# Altium schematic sheet PAGE1-MCU,USB,ADC.SchDoc (part 2 of 2)
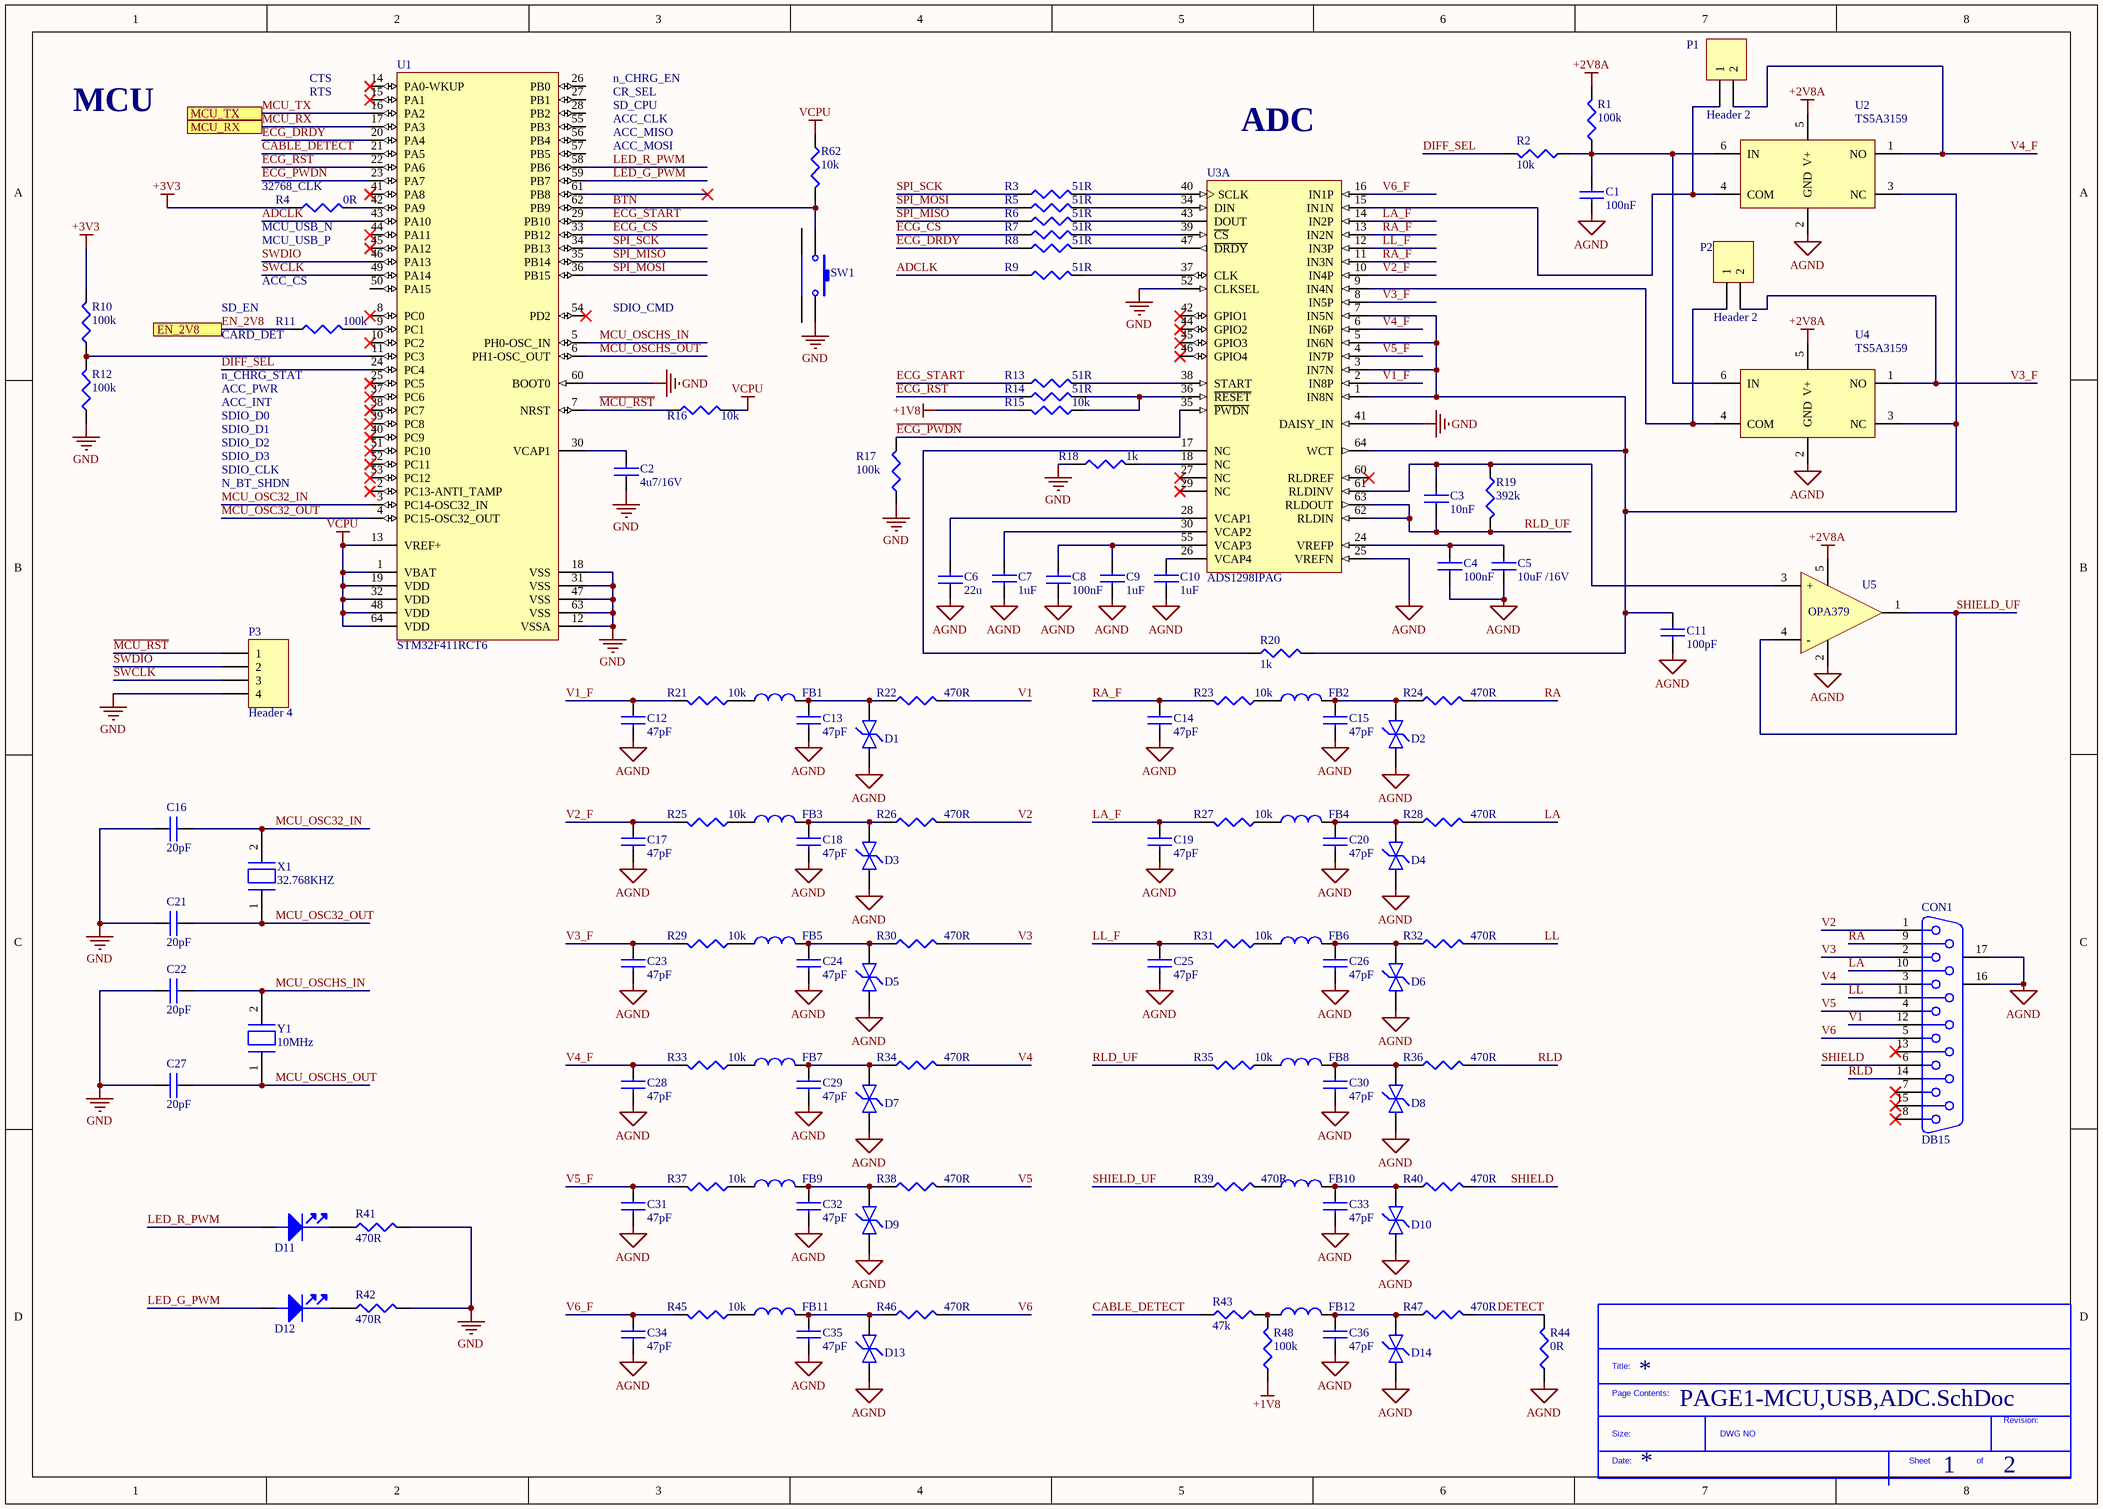
[diagram p1: PAGE1-MCU,USB,ADC.SchDoc]

## Library data of the parts
C1 C4 C8 = 100nF: MURATA - GRM188R71C104KA01J - CAP, MLCC, X7R, 0.1UF, 16V, 0603; Ceramic Capacitor Case: 0603 [1608 Metric]; Capacitance: 0.1; Voltage Rating: 16; Capacitance Tolerance: ± 10%; Dielectric Characteristic: X7; Product Range: GRM Series; SVHC: No SVHC (20-Jun-2016; Supplier 1: Farnell; Manufacturer: MURATA; Manufacturer Part Number: GRM188R71C104KA01J; RoHS: YES; Stock 1: 18297; Pricing 1: 10=0.0145, 100=0.0126, 500=0.0081, 2500=0.0059, 5000=0.0052, 10000=0.0046, 50000=0.0036, 100000=0.0035 (GBP); Packaging: Cut Tape; Operating Temperature Min: -55; Operating Temperature Max: 125; Automotive Qualification Standard: -; MSL: MSL 1 - Unlimited; ComponentLink1URL: http://www.farnell.com/datasheets/2189124.pdf; ComponentLink1Description: http://www.farnell.com/datasheets/2189124.pdf; Supplier Part Number 1: 2688519
C2 = 4u7  16V 0603: MURATA - GRM188R61C475KAAJD - CAP, MLCC, X5R, 4.7UF, 16V, 0603; Ceramic Capacitor Case: 0603 [1608 Metric]; Capacitance: 4.7; Voltage Rating: 16; Capacitance Tolerance: ± 10%; Dielectric Characteristic: X5; Product Range: GRM Series; SVHC: No SVHC (17-Dec-2015)<!--FANDB--><div class="features-and-benefits-container"><div class="features-and-benefits-desc-container"><span class="features-and-benefits-container-desc">SMD Multilayer Ceramic Capacitor, 0603 [1608 Metric], 4.7 µF, 16 V, ± 10%, X5; Supplier 1: Farnell; Manufacturer: MURATA; Manufacturer Part Number: GRM188R61C475KAAJD; RoHS: YES; Stock 1: 5038; Pricing 1: 10=0.16, 100=0.0929, 500=0.076, 1000=0.0618, 2000=0.0605, 4000=0.0425, 20000=0.0409, 40000=0.0355 (GBP); Packaging: Cut Tape; Operating Temperature Min: -55; Operating Temperature Max: 85; Automotive Qualification Standard: -; MSL: MSL 1 - Unlimited; ComponentLink1URL: http://www.farnell.com/datasheets/2079168.pdf; ComponentLink1Description: http://www.farnell.com/datasheets/2079168.pdf; Supplier Part Number 1: 2611924
C3 = 10nF: KEMET - C0603X103K5RECAUTO - CAP, MLCC, AEC-Q200, X7R, 0.01UF, 50V; Manufacturer: TDK EPCOS; Supplier 1: Farnell; Manufacturer Part Number: C0603X103K5RECAUTO; Stock 1: 307350; Pricing 1: 10=0.133, 100=0.0731, 500=0.055, 1000=0.0465, 2000=0.0408, 4000=0.0336, 20000=0.0295 (GBP); ComponentLink1URL: http://www.farnell.com/datasheets/2290180.pdf; ComponentLink1Description: http://www.farnell.com/datasheets/2290180.pdf; Supplier Part Number 1: 2760492
C5 = 10uF /16V: TDK - CGA4J1X5R1C106K125AC - CAP, MLCC, X5R, 10UF, 16V, 0805; Supplier 1: Farnell; Manufacturer: TDK; Manufacturer Part Number: CGA4J1X5R1C106K125AC; RoHS: YES; Stock 1: 8974; Pricing 1: 5=0.41, 50=0.146, 250=0.131, 500=0.12, 1000=0.103 (GBP); ComponentLink1URL: http://bcove.me/e1v54mtm; ComponentLink1Description: http://bcove.me/e1v54mtm; ComponentLink2URL: http://www.farnell.com/datasheets/1936565.pdf; ComponentLink2Description: http://www.farnell.com/datasheets/1936565.pdf; ComponentLink3URL: http://www.farnell.com/datasheets/1683658.pdf; ComponentLink3Description: http://www.farnell.com/datasheets/1683658.pdf; Supplier Part Number 1: 2210948RL
C6 = 22u 6.3V 0805: MULTICOMP - MC0805X226M6R3CT - CAP, MLCC, X5R, 22UF, 0805; Ceramic Capacitor Case: 0805 [2012 Metric]; Capacitance: 22; Voltage Rating: 6.3; Capacitance Tolerance: ± 20%; Dielectric Characteristic: X5; Product Range: MC Series; SVHC: No SVHC (07-Jul-2017); Capacitor Terminals: SMD; Supplier 1: Farnell; Manufacturer: MULTICOMP; Manufacturer Part Number: MC0805X226M6R3CT; RoHS: YES; Stock 1: 74736; Pricing 1: 5=0.128, 50=0.0738, 250=0.0507, 500=0.042, 1500=0.0358 (GBP); Packaging: Cut Tape; Operating Temperature Min: -55; Operating Temperature Max: 85; Automotive Qualification Standard: -; MSL: -; Capacitance Tolerance ±: ± 20%; Operating Temperature Range: -55°C to +85°C<!--FANDB--><div class="features-and-benefits-container"><div class="features-and-benefits-desc-container"><span class="features-and-benefits-container-desc">SMD Multilayer Ceramic Capacitor, 0805 [2012 Metric], 22 µF, 6.3 V, ± 20%, X5R, MC Series</span></div><div class="features-and-benefits-description"><span class="features-benefits-value">The Multicomp MC series is general purpose MLCC capacitors with X5R dielectric material which provides high electrical precision, stability and reliability. This MLCC capacitor consists of a conducting material and electrodes with high density and high efficiency ceramic condensers.</span></div><div class="features-and-benefits-list"><ul class="features-and-benefits-list-list"><li class="features-and-benefits-list-item">Small size with higher capacitance values</li><li class="features-and-benefits-list-item">0201, 0402, 0603, 0805, 1206, 1210, 1812 case sizes available</li><li class="features-and-benefits-list-item">Capacitance value ranging from 100pF to 220?F</li><li class="features-and-benefits-list-item">Capacitor with lead free termination (pure Tin)</li><li class="features-and-benefits-list-item">High electrical precision, stability and reliability</li><li class="features-and-benefits-list-item">Rated voltage of 4V, 6.3V, 10V, 16V, 25V, 50V</li><li class="features-and-benefits-list-item">Operating temperature of -55°C to +85°C</li><li class="features-and-benefits-list-item">Available in ±10% and ±20; ComponentLink1URL: http://www.farnell.com/datasheets/1901289.pdf; ComponentLink1Description: http://www.farnell.com/datasheets/1901289.pdf; ComponentLink2URL: http://www.farnell.com/datasheets/1932399.pdf; ComponentLink2Description: http://www.farnell.com/datasheets/1932399.pdf; Supplier Part Number 1: 1759415
C7 C9 C10 = 1uF: MURATA - GRM188R61H105KAALD - CAP, MLCC, X5R, 1UF, 50V, 0603; Ceramic Capacitor Case: 0603 [1608 Metric]; Capacitance: 1; Voltage Rating: 50; Capacitance Tolerance: ± 10%; Dielectric Characteristic: X5; Product Range: GRM Series; SVHC: No SVHC (17-Dec-2015); Capacitor Terminals: SMD<!--FANDB--><div class="features-and-benefits-container"><div class="features-and-benefits-description"><span class="features-benefits-value">The Murata GRM series capacitors are Multilayer Ceramic Chip Capacitors (MLCC) used for general purpose applications. These MLCC capacitors are classified into temperature compensating and high dielectric constant types depending on the change in electrostatic capacitance due to change in temperature. The temperature compensating capacitors feature a small rate of change in electrostatic capacitance as the temperature changes and are used for applications such as filters and high frequency circuit matching. The high dielectric constant capacitors use materials with a high dielectric constant and feature a large electrostatic capacitance. Typical applications are power supply decoupling and smoothing circuits.</span></div><div class="features-and-benefits-list"><ul class="features-and-benefits-list-list"><li class="features-and-benefits-list-item">Large capacity and small size in a multilayer structure</li><li class="features-and-benefits-list-item">Capacitance value ranging from 0.1pF to 220?F</li><li class="features-and-benefits-list-item">Tin plated external electrodes, excellent solderability</li><li class="features-and-benefits-list-item">Provides good high frequency characteristics</li><li class="features-and-benefits-list-item">Excellent pulse response</li><li class="features-and-benefits-list-item">High reliability</li><li class="features-and-benefits-list-item">Capacitor size varies from 0.4×0.2mm to 5.7×5.0mm</li><li class="features-and-benefits-list-item">Rated voltage of 2.5VDC to 3.15; Supplier 1: Farnell; Manufacturer: MURATA; Manufacturer Part Number: GRM188R61H105KAALD; RoHS: YES; Stock 1: 62682; Pricing 1: 10=0.093, 100=0.062, 500=0.0507, 1000=0.0465, 2000=0.0429, 4000=0.0399, 20000=0.0372, 40000=0.0365 (GBP); Packaging: Cut Tape; Operating Temperature Min: -55; Operating Temperature Max: 85; Automotive Qualification Standard: -; MSL: -; Capacitance Tolerance ±: ± 10%; ComponentLink1URL: http://www.farnell.com/datasheets/2048611.pdf; ComponentLink1Description: http://www.farnell.com/datasheets/2048611.pdf; Supplier Part Number 1: 1845736
C11 = 100pF: MULTICOMP   MCSH18B101K500CT   SMD Multilayer Ceramic Capacitor, MCSH Series, 100 pF,  10%, X7R, 50 V, 0603 [1608 Metric]; Voltage Rating: 50V; Supplier 1: Farnell; Manufacturer: Multicomp; Manufacturer Part Number: MCSH18B101K500CT; Stock 1: 9630; Pricing 1: 10=0.0858, 100=0.0386, 500=0.0266, 1000=0.0203, 2000=0.0176 (EUR); Case/Package: 0603; Case Code (Metric): 1608; Case Code (Imperial): 0603; Min Operating Temperature: -55°C; Max Operating Temperature: 125°C; Packaging: Cut Tape; Capacitance: 100pF; Tolerance: 10%; Dielectric: X7R; Voltage Rating (DC): 50V; REACH SVHC: No SVHC; ComponentLink1URL: https://datasheet.ciiva.com/36858/1825494-36858405.pdf; ComponentLink1Description: https://datasheet.ciiva.com/36858/1825494-36858405.pdf; ComponentLink2URL: https://datasheet.ciiva.com/36855/1825494-36855530.pdf; ComponentLink2Description: https://datasheet.ciiva.com/36855/1825494-36855530.pdf; Supplier Part Number 1: 1856366
C12-C15 C17-C20 C23-C26 C28-C36 = 47pF: CAP CER 47PF 50V NP0 0603; Manufacturer: KEMET; Manufacturer Part Number: C0603C470J5GACTU; Dielectric Material: Ceramic; Tolerance: 5%; Dielectric: C0G; Temperature Coefficient: 30ppm/°C; Supplier 1: Farnell; Stock 1: 63826; Pricing 1: 10=0.0233, 100=0.0154, 500=0.0102, 1000=0.0076, 2000=0.0073 (GBP); Mount: Surface Mount,PCB; Case/Package: 0603; Number of Pins: 2; Case Code (Imperial): 0603; Case Code (Metric): 1608; Contact Material: Tin; Contact Plating: Tin,Matte; Min Operating Temperature: -55°C; Max Operating Temperature: 125°C; Capacitance: 47pF; Voltage Rating: 50V; Voltage Rating (DC): 50V; Package Quantity: 1; Packaging: Tape and Reel; Termination: SMD/SMT; Voltage: 50V; Length: 1.6mm; Height: 0.8mm; Width: 0.031inch; Lead Pitch: 0.7mm; Thickness: 0.034inch; Depth: 0.8mm; Radiation Hardening: No; REACH SVHC: No SVHC; Lead Free: Lead Free; ComponentLink1URL: https://datasheet.ciiva.com/144/docfinderpartnumber-c0603c470j5gactu-144266.pdf; ComponentLink1Description: https://datasheet.ciiva.com/144/docfinderpartnumber-c0603c470j5gactu-144266.pdf; ComponentLink2URL: https://datasheet.ciiva.com/7823/kem-c1003-c0g-smd-7823781.pdf; ComponentLink2Description: https://datasheet.ciiva.com/7823/kem-c1003-c0g-smd-7823781.pdf; ComponentLink3URL: https://datasheet.ciiva.com/7823/kem-c1003-c0g-smd-7823782.pdf; ComponentLink3Description: https://datasheet.ciiva.com/7823/kem-c1003-c0g-smd-7823782.pdf; ComponentLink4URL: https://datasheet.ciiva.com/14588/70095383-14588998.pdf; ComponentLink4Description: https://datasheet.ciiva.com/14588/70095383-14588998.pdf; ComponentLink5URL: https://datasheet.ciiva.com/32432/kem-c1003-c0g-eng-tds-32432423.pdf; ComponentLink5Description: https://datasheet.ciiva.com/32432/kem-c1003-c0g-eng-tds-32432423.pdf; ComponentLink6URL: https://datasheet.ciiva.com/18193/getdatasheetpartid-120905-18193050.pdf; ComponentLink6Description: https://datasheet.ciiva.com/18193/getdatasheetpartid-120905-18193050.pdf; ComponentLink7URL: https://datasheet.ciiva.com/14589/70095383-14589564.pdf; ComponentLink7Description: https://datasheet.ciiva.com/14589/70095383-14589564.pdf; ComponentLink8URL: https://datasheet.ciiva.com/28668/1789732-28668701.pdf; ComponentLink8Description: https://datasheet.ciiva.com/28668/1789732-28668701.pdf; Supplier Part Number 1: 1414639
C16 C21 C22 C27 = 20pF: MURATA - GRM1885C1H200JA01D - CAPACITOR, MLCC, C0G, 20PF, 50V, 0603; Ceramic Capacitor Case: 0603 [1608 Metric]; Capacitance: 20; Voltage Rating: 50; Capacitance Tolerance: ± 5%; Dielectric Characteristic: C0G / NP0; Product Range: GRM Series; SVHC: No SVHC (17-Dec-2015; Supplier 1: Farnell; Manufacturer: MURATA; Manufacturer Part Number: GRM1885C1H200JA01D; RoHS: YES; Stock 1: 5812; Pricing 1: 10=0.0245, 100=0.0159, 500=0.0123, 1000=0.0095, 2000=0.0093, 4000=0.0073, 20000=0.0062, 40000=0.0057 (GBP); Packaging: Cut Tape; Operating Temperature Min: -55; Operating Temperature Max: 125; Automotive Qualification Standard: -; MSL: MSL 1 - Unlimited; ComponentLink1URL: http://www.farnell.com/datasheets/2048077.pdf; ComponentLink1Description: http://www.farnell.com/datasheets/2048077.pdf; Supplier Part Number 1: 2456108
CON1 = 5207827-4: D-Sub Standard Connectors DSUB A15S V/MNT; Manufacturer: TE Connectivity; Body Material: Plastic; Voltage Rating: 125V; Current Rating: 6A; Gender: Female; Connector Type: Receptacle; Number of Positions: 15; Number of Ports: 1; Mating Connector Lock: No (Without); PCB Mount Retention: With; PCB Mounting Orientation: Vertical; Preloaded: Yes; Pitch: 0.108inch; PCB Thickness: 2.36mm; Hole Diameter: 0.12inch; Supplier 1: Farnell; Manufacturer Part Number: 5207827-4; Stock 1: 0; Mount: Through Hole; Color: Black; Contact Plating: Gold,Nickel,Tin; Contact Material: Bronze; Number of Terminals: 15; Housing Color: Black; Housing Material: Thermoplastic; Contact Shape: Round; Min Operating Temperature: -55°C; Max Operating Temperature: 105°C; Package Quantity: 13; Number of Rows: 2; Packaging: Rail/Tube; Termination: Solder; Number of Contacts: 15; Orientation: Straight; Sealable: No (Without); Length: 39.14mm; Width: 12.17mm; Depth: 10.41mm; Termination Post Length: 0.125inch; Radiation Hardening: No; REACH SVHC: Unknown; Lead Free: Lead Free; ELV: Compliant; Flammability Rating: UL94 V-0; ComponentLink1URL: http://www.te.com/commerce/DocumentDelivery/DDEController?Action=srchrtrv&DocNm=5207827&DocType=Customer+Drawing&DocLang=English; ComponentLink1Description: http://www.te.com/commerce/DocumentDelivery/DDEController?Action=srchrtrv&DocNm=5207827&DocType=Customer+Drawing&DocLang=English; ComponentLink2URL: http://www.farnell.com/cad/1652241.pdf; ComponentLink2Description: http://www.farnell.com/cad/1652241.pdf; ComponentLink3URL: http://www.te.com/commerce/DocumentDelivery/DDEController?Action=srchrtrv&DocNm=82068_AMPLIMITE_Straight_Posted_Conns&DocType=Catalog+Section&DocLang=English; ComponentLink3Description: http://www.te.com/commerce/DocumentDelivery/DDEController?Action=srchrtrv&DocNm=82068_AMPLIMITE_Straight_Posted_Conns&DocType=Catalog+Section&DocLang=English; ComponentLink4URL: https://www.verical.com/server-webapp/html/getDatasheet?partID=46991; ComponentLink4Description: https://www.verical.com/server-webapp/html/getDatasheet?partID=46991; ComponentLink5URL: http://www.farnell.com/datasheets/1648470.pdf; ComponentLink5Description: http://www.farnell.com/datasheets/1648470.pdf; Supplier Part Number 1: 1815066
D1-D10 D13 D14 = TPD1E10B06DPYR: TVS DIODE 5.5VWM 14VC 2X2SON; Manufacturer: Texas Instruments; Capacitance: 12pF; Direction: Bidirectional; Breakdown Voltage: 6V; Number of Channels: 1; Reverse Standoff Voltage: 5.5V; Clamping Voltage: 14V; Peak Pulse Power: 90W; Power Line Protection: No; Leakage Current: 100nA; ESD Protection: Yes; Test Current: 1mA; Element Configuration: Single; Peak Pulse Current: 5A; Interface: GPIO; Supplier 1: Farnell; Manufacturer Part Number: TPD1E10B06DPYR; Stock 1: 6208; Pricing 1: 1=0.415, 50=0.312, 100=0.117, 250=0.108, 500=0.0992, 1000=0.0902 (EUR); Case/Package: 0402; Number of Pins: 2; Contact Plating: Gold; Min Operating Temperature: -40°C; Max Operating Temperature: 125°C; Package Quantity: 1; Packaging: Tape and Reel; Number of Bidirectional Channels: 1; Min Breakdown Voltage: 6V; Working Voltage: 5.5V; Max Reverse Leakage Current: 100nA; Length: 1.1mm; Height: 0.35mm; Width: 0.7mm; Radiation Hardening: No; REACH SVHC: No SVHC; Lead Free: Lead Free; ComponentLink1URL: https://datasheet.ciiva.com/26005/sllseb1b-26005840.pdf; ComponentLink1Description: https://datasheet.ciiva.com/26005/sllseb1b-26005840.pdf; ComponentLink2URL: https://datasheet.ciiva.com/46384/1877100-46384054.pdf; ComponentLink2Description: https://datasheet.ciiva.com/46384/1877100-46384054.pdf; ComponentLink3URL: https://datasheet.ciiva.com/14195/tpd1e10b06-14195178.pdf; ComponentLink3Description: https://datasheet.ciiva.com/14195/tpd1e10b06-14195178.pdf; ComponentLink4URL: https://datasheet.ciiva.com/22691/1877100-22691786.pdf; ComponentLink4Description: https://datasheet.ciiva.com/22691/1877100-22691786.pdf; ComponentLink5URL: https://datasheet.ciiva.com/2961/tpd1e10b06-2961245.pdf; ComponentLink5Description: https://datasheet.ciiva.com/2961/tpd1e10b06-2961245.pdf; ComponentLink6URL: https://datasheet.ciiva.com/2961/tpd1e10b06-2961246.pdf; ComponentLink6Description: https://datasheet.ciiva.com/2961/tpd1e10b06-2961246.pdf; ComponentLink7URL: https://datasheet.ciiva.com/6574/tpd1e10b06-6574654.pdf; ComponentLink7Description: https://datasheet.ciiva.com/6574/tpd1e10b06-6574654.pdf; Supplier Part Number 1: 2345930
D11 D12 = LED RED: BROADCOM LIMITED - HSMS-C190 - LED, RED, 10MCD, 626NM; LED Mounting: SMD; Forward Current If: 20; Forward Voltage: 2.1; Wavelength Typ: 626; Luminous Intensity: 10; Viewing Angle: 170°; Lens Shape: Rectangular; SVHC: No SVHC (17-Dec-2015)<!--FANDB--><div class="features-and-benefits-container"><div class="features-and-benefits-description"><span class="features-benefits-value">The HSMS-C190 is a HER SMD Chip LED with untinted/diffused lens, made of GaP. It is designed in an industry standard package 1.6 x 0.8mm footprint with 0.8mm profile. It is compatible with IR reflow solder processes. The small size and wide viewing angle make this LED prime choices for backlighting applications and front panel illumination especially where space is a premium.</span></div><div class="features-and-benefits-list"><ul class="features-and-benefits-list-list"><li class="features-and-benefits-list-item">Small size</li><li class="features-and-benefits-list-item">Industry standard footprint</li><li class="features-and-benefits-list-item">Compatible with IR solder</li><li class="features-and-benefits-list-item">Diffused optics</li><li class="features-and-benefits-list-item">-40 to 85; Supplier 1: Farnell; Manufacturer: BROADCOM LIMITED; Manufacturer Part Number: HSMS-C190; RoHS: YES; Stock 1: 7534; Pricing 1: 1=0.361, 10=0.256, 50=0.235, 100=0.106, 200=0.101 (GBP); LED Colour: Red; Bulb Size: -; Packaging: Cut Tape; Product Range: -; Automotive Qualification Standard: -; MSL: -; ComponentLink1URL: http://www.farnell.com/datasheets/313031.pdf; ComponentLink1Description: http://www.farnell.com/datasheets/313031.pdf; ComponentLink2URL: http://www.farnell.com/datasheets/1681524.pdf; ComponentLink2Description: http://www.farnell.com/datasheets/1681524.pdf; ComponentLink3URL: http://www.farnell.com/datasheets/2165483.pdf; ComponentLink3Description: http://www.farnell.com/datasheets/2165483.pdf; Supplier Part Number 1: 2497356
FB1-FB12 = BLM15PG100SN1D: Ferrite Beads Multi-Layer 10Ohm 100MHz 1A 50mOhm DCR 0402 T/R; Manufacturer: Murata; Material: Steel; Impedance: 10R; Number of Lines: 1; DC Resistance (DCR): 25mR; Shielding: Unshielded; Tolerance: 25%; Supplier 1: Farnell; Manufacturer Part Number: BLM15PG100SN1D; Stock 1: 794; Pricing 1: 10=0.03, 100=0.0217, 500=0.0163, 2500=0.0122, 5000=0.01, 10000=0.0089, 50000=0.007 (EUR); Case/Package: 0402; Number of Pins: 2; Core Material: Ferrite; Case Code (Metric): 1005; Case Code (Imperial): 0402; Min Operating Temperature: -55°C; Max Operating Temperature: 125°C; Packaging: Tape and Reel; Current Rating: 1A; Number of Circuits: 1; Package Quantity: 1; Max Current Rating: 1A; Termination: SMD/SMT; Max DC Current: 1A; Test Frequency: 100MHz; Length: 1mm; Height: 0.5mm; Width: 0.5mm; Depth: 0.55mm; REACH SVHC: No SVHC; Lead Free: Lead Free; ComponentLink1URL: https://datasheet.ciiva.com/41449/001172209-da-01-en-drossel-0402-10r-1-0x0-5mm-10000st-41449496.pdf; ComponentLink1Description: https://datasheet.ciiva.com/41449/001172209-da-01-en-drossel-0402-10r-1-0x0-5mm-10000st-41449496.pdf; ComponentLink2URL: https://datasheet.ciiva.com/46423/1851892-46423898.pdf; ComponentLink2Description: https://datasheet.ciiva.com/46423/1851892-46423898.pdf; ComponentLink3URL: https://datasheet.ciiva.com/6211/l0110e-6211726.pdf; ComponentLink3Description: https://datasheet.ciiva.com/6211/l0110e-6211726.pdf; Supplier Part Number 1: 2443233
P1 P2 = Header 2: Header, 2-Pin; LatestRevisionDate: 17-Jul-2002; LatestRevisionNote: Re-released for DXP Platform.; Publisher: Altium Limited
P3 = Header 4: Header, 4-Pin; LatestRevisionDate: 17-Jul-2002; LatestRevisionNote: Re-released for DXP Platform.; Publisher: Altium Limited
R1 R10-R12 R17 R48 = 100k: MULTICOMP - MCMR06X104 JTL - RES, CERAMIC, 100K, 5%, 0.1W, 0603; Resistance: 100; Voltage Rating: 75; Resistor Case Style: 0603 [1608 Metric]; Product Range: MCMR Series; Temperature Coefficient: ± 100; Resistor Mounting: Surface Mount Device<!--FANDB--><div class="features-and-benefits-container"><div class="features-and-benefits-description"><span class="features-benefits-value">The Multicomp MCMR series resistors are automotive grade, anti sulphured thick film chip resistor. The resistance range includes E24 and E96 decade values from 1ohm to 10Mohm. These resistors are constructed on top of a high grade ceramic body.</span></div><div class="features-and-benefits-list"><ul class="features-and-benefits-list-list"><li class="features-and-benefits-list-item">EIA 0402, 0603, 0805, 1206 chip sizes available</li><li class="features-and-benefits-list-item">High reliability and stability</li><li class="features-and-benefits-list-item">Automotive grade AEC-Q200 compliant</li><li class="features-and-benefits-list-item">Complaint with (IEC 60068-1) 55/155/56 climatic category</li><li class="features-and-benefits-list-item">Maximum operation voltage of 50V, 75V, 150V and 200V</li><li class="features-and-benefits-list-item">Power rating of 62.5mW, 100mW, 125mW and 250mW</li><li class="features-and-benefits-list-item">Available in ±1% and ±5% tolerance</li><li class="features-and-benefits-list-item">Temperature coefficient (TCR) of +200ppm/°C, +100ppm/°C and -200ppm/°C to +400ppm/°C</li><li class="features-and-benefits-list-item">Operating temperature range -55°C to 155; Supplier 1: Farnell; Manufacturer: MULTICOMP; Manufacturer Part Number: MCMR06X104 JTL; RoHS: Y-EX; Stock 1: 187; Pricing 1: 10=0.0109, 100=0.0085, 500=0.006, 1000=0.0048, 2500=0.004, 5000=0.003, 25000=0.002, 50000=0.0016 (GBP); Power Rating: 100; Resistance Tolerance: ± 5%; Packaging: Cut Tape; Resistor Element Material: Ceramic; Automotive Qualification Standard: -; ComponentLink1URL: http://www.farnell.com/datasheets/1716707.pdf; ComponentLink1Description: http://www.farnell.com/datasheets/1716707.pdf; Supplier Part Number 1: 2073357
R2 R15 R16 R21 R23 R25 R27 R29 R31 R33 R35 R37 R45 R62 = 10k: MULTICOMP - MCMR06X103 JTL - RES, CERAMIC, 10K, 5%, 0.1W, 0603; Resistance: 10; Voltage Rating: 75; Resistor Case Style: 0603 [1608 Metric]; Power Rating: 100; Product Range: MCMR Series; Temperature Coefficient: ± 100; Automotive Qualification Standard: -<!--FANDB--><div class="features-and-benefits-container"><div class="features-and-benefits-description"><span class="features-benefits-value">The Multicomp MCMR series resistors are automotive grade, anti sulphured thick film chip resistor. The resistance range includes E24 and E96 decade values from 1ohm to 10Mohm. These resistors are constructed on top of a high grade ceramic body.</span></div><div class="features-and-benefits-list"><ul class="features-and-benefits-list-list"><li class="features-and-benefits-list-item">EIA 0402, 0603, 0805, 1206 chip sizes available</li><li class="features-and-benefits-list-item">High reliability and stability</li><li class="features-and-benefits-list-item">Automotive grade AEC-Q200 compliant</li><li class="features-and-benefits-list-item">Complaint with (IEC 60068-1) 55/155/56 climatic category</li><li class="features-and-benefits-list-item">Maximum operation voltage of 50V, 75V, 150V and 200V</li><li class="features-and-benefits-list-item">Power rating of 62.5mW, 100mW, 125mW and 250mW</li><li class="features-and-benefits-list-item">Available in ±1% and ±5% tolerance</li><li class="features-and-benefits-list-item">Temperature coefficient (TCR) of +200ppm/°C, +100ppm/°C and -200ppm/°C to +400ppm/°C</li><li class="features-and-benefits-list-item">Operating temperature range -55°C to 155; Supplier 1: Farnell; Manufacturer: MULTICOMP; Manufacturer Part Number: MCMR06X103 JTL; RoHS: Y-EX; Stock 1: 19791; Pricing 1: 10=0.0087, 100=0.0074, 500=0.0061, 1000=0.0048, 2500=0.0032, 5000=0.0024, 25000=0.0016, 50000=0.0013 (GBP); Resistance Tolerance: ± 5%; Packaging: Cut Tape; Resistor Element Material: Ceramic; ComponentLink1URL: http://www.farnell.com/datasheets/1716707.pdf; ComponentLink1Description: http://www.farnell.com/datasheets/1716707.pdf; Supplier Part Number 1: 2073356
R3 R5-R9 R13 R14 = 51R: RES SMD 51 OHM 1% 1/10W 0603; Manufacturer: Vishay; Manufacturer Part Number: CRCW060351R0FKEA; Power Rating: 100mW; Voltage Rating: 75V; Temperature Coefficient: 100ppm/°C; Supplier 1: Farnell; Stock 1: 1083; Pricing 1: 10=0.0116, 250=0.0087, 500=0.0059, 1250=0.0052, 2500=0.0046 (GBP); Case/Package: 0603; Number of Pins: 2; Weight: 7.1E-05oz; Case Code (Imperial): 0603; Case Code (Metric): 1608; Contact Plating: Tin; Min Operating Temperature: -55°C; Max Operating Temperature: 155°C; Resistance: 51R; Tolerance: 1%; Packaging: Tape and Reel; Package Quantity: 10; Composition: Thick Film; Number of Terminations: 2; Military Standard: Not; Termination: SMD/SMT; Max Power Dissipation: 100mW; Voltage Rating (DC): 75V; Working Voltage: 75V; Length: 1.55mm; Height: 0.45mm; Width: 0.85mm; Depth: 0.85mm; Radiation Hardening: No; REACH SVHC: Unknown; Lead Free: Lead Free; ComponentLink1URL: https://datasheet.ciiva.com/11809/0900766b80d98afc-11809837.pdf; ComponentLink1Description: https://datasheet.ciiva.com/11809/0900766b80d98afc-11809837.pdf; ComponentLink2URL: https://datasheet.ciiva.com/3257/dcrcwe3-3257701.pdf; ComponentLink2Description: https://datasheet.ciiva.com/3257/dcrcwe3-3257701.pdf; ComponentLink3URL: https://datasheet.ciiva.com/5542/dcrcwe3-109170-5542133.pdf; ComponentLink3Description: https://datasheet.ciiva.com/5542/dcrcwe3-109170-5542133.pdf; ComponentLink4URL: https://datasheet.ciiva.com/7690/1697337-7690727.pdf; ComponentLink4Description: https://datasheet.ciiva.com/7690/1697337-7690727.pdf; ComponentLink5URL: https://datasheet.ciiva.com/7690/1720486-7690872.pdf; ComponentLink5Description: https://datasheet.ciiva.com/7690/1720486-7690872.pdf; ComponentLink6URL: https://datasheet.ciiva.com/22870/70201119-22870938.pdf; ComponentLink6Description: https://datasheet.ciiva.com/22870/70201119-22870938.pdf; ComponentLink7URL: https://datasheet.ciiva.com/2465/dcrcwe3-2465963.pdf; ComponentLink7Description: https://datasheet.ciiva.com/2465/dcrcwe3-2465963.pdf; ComponentLink8URL: https://datasheet.ciiva.com/16763/70201119-16763963.pdf; ComponentLink8Description: https://datasheet.ciiva.com/16763/70201119-16763963.pdf; ComponentLink9URL: https://datasheet.ciiva.com/2465/dcrcwe3-2465964.pdf; ComponentLink9Description: https://datasheet.ciiva.com/2465/dcrcwe3-2465964.pdf; ComponentLink10URL: https://datasheet.ciiva.com/2465/dcrcwe3-2465965.pdf; ComponentLink10Description: https://datasheet.ciiva.com/2465/dcrcwe3-2465965.pdf; ComponentLink11URL: https://datasheet.ciiva.com/26316/fld-crcw-e3-data-en-26316559.pdf; ComponentLink11Description: https://datasheet.ciiva.com/26316/fld-crcw-e3-data-en-26316559.pdf; Supplier Part Number 1: 1652889
R4 R44 = 0R: BOURNS - CR0603-J/-000ELF - RES, THICK FILM, 0R, 5%, 0.1W, 0603; Resistance: 0; Voltage Rating: 50; Resistor Case Style: 0603 [1608 Metric]; Power Rating: 100; Product Range: CR Series; SVHC: No SVHC (17-Dec-2015); Resistor Mounting: Surface Mount Device<!--FANDB--><div class="features-and-benefits-container"><div class="features-and-benefits-description"><span class="features-benefits-value">The Bourns CR series are standard thick film chip resistors. These resistors provide flexibility of performance, space saving and low cost. The Resistance range includes E96 and E24 decade values from 1ohm to 10Mohm.</span></div><div class="features-and-benefits-list"><ul class="features-and-benefits-list-list"><li class="features-and-benefits-list-item">0201, 0402, 0603, 0805, 1206, 1210, 2010, 2512 standard case sizes available</li><li class="features-and-benefits-list-item">±1% and ±5% tolerance</li><li class="features-and-benefits-list-item">±100ppm/°C, ±200ppm/°C and ±250ppm/°C TCR values available</li><li class="features-and-benefits-list-item">Power rating selectable for 50mW, 63mW, 0.1W, 0.125W, 0.25W, 0.5W and 1W based on ordering</li><li class="features-and-benefits-list-item">Jumpers are available for all size</li><li class="features-and-benefits-list-item">3 layer termination process with nickel barrier prevents leaching & provides excellent solderability</li><li class="features-and-benefits-list-item">Suitable for all type of soldering processes</li><li class="features-and-benefits-list-item">Tight dimensional tolerances</li><li class="features-and-benefits-list-item">Maximum working voltage depends on case size</li><li class="features-and-benefits-list-item">Operating temperature of -55°C to +125°C(CR0201) and -55°C to +155; Supplier 1: Farnell; Manufacturer: BOURNS; Manufacturer Part Number: CR0603-J/-000ELF; RoHS: YES; Stock 1: 58200; Pricing 1: 10=0.0146, 250=0.0097, 1000=0.0073, 5000=0.0049, 12500=0.0042 (GBP); Resistance Tolerance: ± 5%; Packaging: Cut Tape; Resistor Element Material: Thick Film; Temperature Coefficient: -; Automotive Qualification Standard: -; MSL: MSL 1 - Unlimited; ComponentLink1URL: http://www.bourns.com/engineering/CHPREZTR/cr0603.stp; ComponentLink1Description: http://www.bourns.com/engineering/CHPREZTR/cr0603.stp; ComponentLink2URL: http://www.farnell.com/datasheets/2178762.pdf; ComponentLink2Description: http://www.farnell.com/datasheets/2178762.pdf; Supplier Part Number 1: 2008343
R18 R20 = 1k: MULTICOMP - MCMR06X102 JTL - RES, CERAMIC, 1K, 5%, 0.1W, 0603; Resistance: 1; Voltage Rating: 75; Resistor Case Style: 0603 [1608 Metric]; Power Rating: 100; Product Range: MCMR Series; Temperature Coefficient: ± 100; Resistor Mounting: Surface Mount Device<!--FANDB--><div class="features-and-benefits-container"><div class="features-and-benefits-description"><span class="features-benefits-value">The Multicomp MCMR series resistors are automotive grade, anti sulphured thick film chip resistor. The resistance range includes E24 and E96 decade values from 1ohm to 10Mohm. These resistors are constructed on top of a high grade ceramic body.</span></div><div class="features-and-benefits-list"><ul class="features-and-benefits-list-list"><li class="features-and-benefits-list-item">EIA 0402, 0603, 0805, 1206 chip sizes available</li><li class="features-and-benefits-list-item">High reliability and stability</li><li class="features-and-benefits-list-item">Automotive grade AEC-Q200 compliant</li><li class="features-and-benefits-list-item">Complaint with (IEC 60068-1) 55/155/56 climatic category</li><li class="features-and-benefits-list-item">Maximum operation voltage of 50V, 75V, 150V and 200V</li><li class="features-and-benefits-list-item">Power rating of 62.5mW, 100mW, 125mW and 250mW</li><li class="features-and-benefits-list-item">Available in ±1% and ±5% tolerance</li><li class="features-and-benefits-list-item">Temperature coefficient (TCR) of +200ppm/°C, +100ppm/°C and -200ppm/°C to +400ppm/°C</li><li class="features-and-benefits-list-item">Operating temperature range -55°C to 155; Supplier 1: Farnell; Manufacturer: MULTICOMP; Manufacturer Part Number: MCMR06X102 JTL; RoHS: Y-EX; Stock 1: 18133; Pricing 1: 10=0.0089, 100=0.0076, 500=0.0063, 1000=0.0049, 2500=0.0033, 5000=0.0024, 25000=0.0016, 50000=0.0013 (GBP); Resistance Tolerance: ± 5%; Packaging: Cut Tape; Resistor Element Material: Ceramic; Automotive Qualification Standard: -; ComponentLink1URL: http://www.farnell.com/datasheets/1716707.pdf; ComponentLink1Description: http://www.farnell.com/datasheets/1716707.pdf; Supplier Part Number 1: 2073354
R19 = 392k: Resistor; Thick Film; Res 392 Kilohms; Pwr-Rtg 0.1 W; Tol 1%; SMT; 0603; Tape & Reel; Manufacturer: Panasonic; Manufacturer Part Number: ERJ-3EKF3923V; Voltage Rating: 75V; Resistance: 392kR; Power Rating: 100mW; Temperature Coefficient: 100ppm/°C; Voltage Rating (DC): 50V; Supplier 1: Farnell; Stock 1: 6940; Pricing 1: 10=0.0416, 100=0.0243, 500=0.018, 1000=0.0161, 2500=0.0142 (EUR); Mount: Surface Mount; Case/Package: 0603; Case Code (Metric): 1608; Case Code (Imperial): 0603; Contact Plating: Tin; Min Operating Temperature: -55°C; Max Operating Temperature: 155°C; Packaging: Tape and Reel; Tolerance: 1%; Package Quantity: 5000; Composition: Thick Film; Number of Terminations: 2; Termination: SMD/SMT; Military Standard: Not; Max Power Dissipation: 100mW; Length: 1.6mm; Height: 0.022inch; Width: 0.031inch; Depth: 0.8mm; Radiation Hardening: No; REACH SVHC: Yes; Lead Free: Lead Free; ComponentLink1URL: https://datasheet.ciiva.com/9117/aoa0000ce2-9117256.pdf; ComponentLink1Description: https://datasheet.ciiva.com/9117/aoa0000ce2-9117256.pdf; ComponentLink2URL: https://datasheet.ciiva.com/16772/70260748-16772474.pdf; ComponentLink2Description: https://datasheet.ciiva.com/16772/70260748-16772474.pdf; ComponentLink3URL: https://datasheet.ciiva.com/30160/aoa0000ce2-30160714.pdf; ComponentLink3Description: https://datasheet.ciiva.com/30160/aoa0000ce2-30160714.pdf; ComponentLink4URL: https://datasheet.ciiva.com/24069/aoa0000ce2-24069454.pdf; ComponentLink4Description: https://datasheet.ciiva.com/24069/aoa0000ce2-24069454.pdf; Supplier Part Number 1: 2303281
R22 R24 R26 R28 R30 R32 R34 R36 R38-R42 R46 R47 = 470R: MULTICOMP - MCMR06X471 JTL - RES, CERAMIC, 470R, 5%, 0.1W, 0603; Supplier 1: Farnell; Manufacturer: MULTICOMP; Manufacturer Part Number: MCMR06X471 JTL; RoHS: Y-EX; Stock 1: 3786; Pricing 1: 10=0.0089, 100=0.0076, 500=0.0063, 1000=0.0049, 2500=0.0033, 5000=0.0024, 25000=0.0016, 50000=0.0013 (GBP); ComponentLink1URL: http://www.farnell.com/datasheets/1716707.pdf; ComponentLink1Description: http://www.farnell.com/datasheets/1716707.pdf; Supplier Part Number 1: 2073513
R43 = 47k: MULTICOMP - MCMR06X4702FTL - RES, CERAMIC, 47K, 1%, 0.1W, 0603; Resistance: 47; Voltage Rating: 75; Resistor Case Style: 0603 [1608 Metric]; Power Rating: 100; Product Range: MCMR Series; Temperature Coefficient: ± 100; Automotive Qualification Standard: -<!--FANDB--><div class="features-and-benefits-container"><div class="features-and-benefits-description"><span class="features-benefits-value">The Multicomp MCMR series resistors are automotive grade, anti sulphured thick film chip resistor. The resistance range includes E24 and E96 decade values from 1ohm to 10Mohm. These resistors are constructed on top of a high grade ceramic body.</span></div><div class="features-and-benefits-list"><ul class="features-and-benefits-list-list"><li class="features-and-benefits-list-item">EIA 0402, 0603, 0805, 1206 chip sizes available</li><li class="features-and-benefits-list-item">High reliability and stability</li><li class="features-and-benefits-list-item">Automotive grade AEC-Q200 compliant</li><li class="features-and-benefits-list-item">Complaint with (IEC 60068-1) 55/155/56 climatic category</li><li class="features-and-benefits-list-item">Maximum operation voltage of 50V, 75V, 150V and 200V</li><li class="features-and-benefits-list-item">Power rating of 62.5mW, 100mW, 125mW and 250mW</li><li class="features-and-benefits-list-item">Available in ±1% and ±5% tolerance</li><li class="features-and-benefits-list-item">Temperature coefficient (TCR) of +200ppm/°C, +100ppm/°C and -200ppm/°C to +400ppm/°C</li><li class="features-and-benefits-list-item">Operating temperature range -55°C to 155; Supplier 1: Farnell; Manufacturer: MULTICOMP; Manufacturer Part Number: MCMR06X4702FTL; RoHS: Y-EX; Stock 1: 21427; Pricing 1: 10=0.0115, 100=0.009, 500=0.0064, 1000=0.0051, 2500=0.0042, 5000=0.0032, 25000=0.0021, 50000=0.0017 (GBP); Resistance Tolerance: ± 1%; Packaging: Cut Tape; Resistor Element Material: Ceramic; ComponentLink1URL: http://www.farnell.com/datasheets/1716707.pdf; ComponentLink1Description: http://www.farnell.com/datasheets/1716707.pdf; Supplier Part Number 1: 2073510
SW1 = PTS645VH58-2LFS: SWITCH TACTILE SPST-NO 0.05A 12V; Manufacturer: ITT C&K; Mechanical Life: 100000Cycles; Actuator Material: Nylon,Polyamide; Operating Force: 200gf; Throw Configuration: SPST; Max Current Rating: 50mA; Illumination Type: Non-Illuminated,Illuminated; Switch Function: Off-Mom; Supplier 1: Farnell; Manufacturer Part Number: PTS645VH58-2LFS; Stock 1: 7080; Pricing 1: 1=0.189, 10=0.175, 50=0.165, 100=0.141, 300=0.135, 700=0.107, 2000=0.105, 7000=0.103 (GBP); Mount: Through Hole; Contact Plating: Silver; Colour: Black; Contact Material: Brass,Silver; Min Operating Temperature: -20°C; Max Operating Temperature: 60°C; Package Quantity: 1000; Packaging: Bulk; Current Rating: 50mA; Voltage Rating (DC): 12V; Termination: PC Pins; Orientation: Right Angle; Length: 8.5mm; Depth: 9.8mm; REACH SVHC: No SVHC; Lead Free: Lead Free; ComponentLink1URL: https://datasheet.ciiva.com/29903/getdatasheetpartid-780336-29903805.pdf; ComponentLink1Description: https://datasheet.ciiva.com/29903/getdatasheetpartid-780336-29903805.pdf; ComponentLink2URL: https://datasheet.ciiva.com/22637/1707731-22637360.pdf; ComponentLink2Description: https://datasheet.ciiva.com/22637/1707731-22637360.pdf; Supplier Part Number 1: 2320088
U1 = STM32F411RCT6: STMICROELECTRONICS         STM32F411RCT6             32 Bit Microcontroller, Batch Acquisition Mode, ARM Cortex-M4, 100 MHz, 256 KB, 128 KB, 64 Pins; Max Power Dissipation: 313mW; Interface: I2C,SPI,USB,I2S,IrDA,MMC,SDIO,SD,UART,USART,LIN; Min Supply Voltage: 1.7V; Max Supply Voltage: 3.6V; Operating Supply Voltage: 3.3V; RAM Size: 128KB; Number of I/Os: 50; Number of Timers/Counters: 8; Frequency: 100MHz; Oscillator Type: Internal; Data Bus Width: 32b; Watchdog Timer: Yes; Memory Type: FLASH; Memory Size: 256KB; Number of ADC Channels: 16; Peripherals: Brown-out Detect/Reset,POR,PWM,WDT,DMA; Supplier 1: Farnell; Manufacturer: STMicroelectronics; Manufacturer Part Number: STM32F411RCT6; Stock 1: 978; Pricing 1: 1=6.01, 10=4.67, 25=4.45, 50=4.22, 100=4, 250=3.85, 500=2.88 (EUR); Mount: Surface Mount; Case/Package: LQFP; Number of Pins: 64; Weight: 0.012088oz; Min Operating Temperature: -40°C; Max Operating Temperature: 85°C; Packaging: Tray; Package Quantity: 960; Number of Programmable I/O: 50; Max Frequency: 100MHz; Core Architecture: ARM; Length: 10mm; Width: 10mm; Radiation Hardening: No; REACH SVHC: No SVHC; Lead Free: Lead Free; ComponentLink1URL: https://datasheet.ciiva.com/48494/dm00115249-48494030.pdf; ComponentLink1Description: https://datasheet.ciiva.com/48494/dm00115249-48494030.pdf; Supplier Part Number 1: 2456966
U2 U4 = TS5A3159MDBVREP: Manufacturer: Texas Instruments; Min Supply Voltage: 1.65V; Max Supply Voltage: 5.5V; Number of Channels: 1; Number of Outputs: 2; On-State Resistance: 1.1R; Turn-On Delay Time: 35ns; Turn-Off Delay Time: 20ns; Max Supply Current: 100nA; Supply Type: Single; Throw Configuration: SPDT; Bandwidth: 100MHz; Supplier 1: Farnell; Manufacturer Part Number: TS5A3159MDBVREP; Stock 1: 2959; Pricing 1: 1=1.72, 25=1.46, 50=1.32, 100=1.17, 250=1.1, 500=1.02 (EUR); Mount: Surface Mount; Case/Package: SOT-23-6; Number of Pins: 6; Weight: 0.000229oz; Min Operating Temperature: -55°C; Max Operating Temperature: 125°C; Packaging: Tape and Reel; Package Quantity: 3000; Number of Inputs: 1; Operating Supply Current: 100nA; Radiation Hardening: No; REACH SVHC: No SVHC; Lead Free: Lead Free; ComponentLink1URL: https://datasheet.ciiva.com/4918/scds217b-126734-4918496.pdf; ComponentLink1Description: https://datasheet.ciiva.com/4918/scds217b-126734-4918496.pdf; ComponentLink2URL: https://datasheet.ciiva.com/14435/ts5a3159-ep-14435168.pdf; ComponentLink2Description: https://datasheet.ciiva.com/14435/ts5a3159-ep-14435168.pdf; ComponentLink3URL: https://datasheet.ciiva.com/1672/ts5a3159-ep-1672100.pdf; ComponentLink3Description: https://datasheet.ciiva.com/1672/ts5a3159-ep-1672100.pdf; ComponentLink4URL: https://datasheet.ciiva.com/41461/001187279-da-01-en-ic-switch-s-ts5a3159mdbvrep-sot-23-6-tid-41461728.pdf; ComponentLink4Description: https://datasheet.ciiva.com/41461/001187279-da-01-en-ic-switch-s-ts5a3159mdbvrep-sot-23-6-tid-41461728.pdf; ComponentLink5URL: https://datasheet.ciiva.com/1672/ts5a3159-ep-1672101.pdf; ComponentLink5Description: https://datasheet.ciiva.com/1672/ts5a3159-ep-1672101.pdf; ComponentLink6URL: https://datasheet.ciiva.com/1672/ts5a3159-ep-1672102.pdf; ComponentLink6Description: https://datasheet.ciiva.com/1672/ts5a3159-ep-1672102.pdf; Supplier Part Number 1: 2459821
U3 = ADS1298IPAG: TEXAS INSTRUMENTS   ADS1298IPAG.   ANALOG FRONT END, 24 BIT, 100KHZ, TQFP-64; Number of Channels: 8; Max Power Dissipation: 8.8mW; Max Supply Voltage: 5.25V; Min Supply Voltage: 2.7V; Interface: SPI; Resolution: 24b; Number of Bits: 24; Sampling Rate: 32KS/s; Operating Supply Current: 3.1mA; Max Supply Voltage (DC): 3.6V; Min Supply Voltage (DC): 1.65V; Signal to Noise Ratio (SNR): 112dB; Power Consumption: 6mW; Supplier 1: Farnell; Manufacturer: Texas Instruments; Manufacturer Part Number: ADS1298IPAG; Stock 1: 268; Pricing 1: 1=32.95, 5=31.83, 10=30.27, 25=30.11, 50=26.46 (GBP); Case/Package: TQFP; Number of Pins: 64; Contact Plating: Gold; Min Operating Temperature: -40°C; Max Operating Temperature: 85°C; Package Quantity: 160; Number of Converters: 8; Packaging: Tray; Number of A/D Converters: 8; Conversion Rate: 32KS/s; Number of Inputs: 8; Type: General Purpose; Length: 10.2mm; Height: 1.05mm; Width: 10.2mm; Radiation Hardening: No; REACH SVHC: No SVHC; Lead Free: Lead Free; ComponentLink1URL: https://datasheet.ciiva.com/22621/1716507-22621445.pdf; ComponentLink1Description: https://datasheet.ciiva.com/22621/1716507-22621445.pdf; ComponentLink2URL: https://datasheet.ciiva.com/26796/ads1298ipag-26796374.pdf; ComponentLink2Description: https://datasheet.ciiva.com/26796/ads1298ipag-26796374.pdf; ComponentLink3URL: https://datasheet.ciiva.com/1168/1796012-1168139.pdf; ComponentLink3Description: https://datasheet.ciiva.com/1168/1796012-1168139.pdf; ComponentLink4URL: https://datasheet.ciiva.com/25910/ads1294-25910079.pdf; ComponentLink4Description: https://datasheet.ciiva.com/25910/ads1294-25910079.pdf; Supplier Part Number 1: 2323669
U5 = OPA379AIDBVT: IC OPAMP GP 90KHZ RRO SOT23-5; Manufacturer: Texas Instruments; Max Supply Voltage: 5.5V; Min Supply Voltage: 1.8V; Voltage Gain: 120dB; Nominal Supply Current: 5.5uA; Common Mode Rejection Ratio: 90dB; Number of Channels: 1; Slew Rate: 0.03V/µs; Max I/O Voltage: 1.5mV; Input Bias Current: 50pA; Operating Supply Current: 2.9uA; Output Current per Channel: 5mA; Power Supply Rejection Ratio (PSRR): 113.98dB; Supplier 1: Farnell; Manufacturer Part Number: OPA379AIDBVT; Stock 1: 215; Pricing 1: 1=1.09, 25=0.954, 50=0.841, 100=0.728, 250=0.686, 500=0.644, 1000=0.509, 2500=0.502 (EUR); Case/Package: SOT-23; Number of Pins: 5; Min Operating Temperature: -40°C; Max Operating Temperature: 125°C; Packaging: Tape and Reel; Bandwidth: 90kHz; Unity Gain Bandwidth Product: 90kHz; Package Quantity: 250; Nominal Gain Bandwidth Product: 90kHz; Input Offset Voltage (Vos): 1.5mV; Gain Bandwidth Product: 90kHz; Number of Circuits: 1; Number of Amplifiers: 1; Number of Elements: 1; Length: 2.9mm; Height: 1.15mm; Width: 1.6mm; Radiation Hardening: No; REACH SVHC: No SVHC; Lead Free: Lead Free; ComponentLink1URL: https://datasheet.ciiva.com/22700/1830903-22700334.pdf; ComponentLink1Description: https://datasheet.ciiva.com/22700/1830903-22700334.pdf; ComponentLink2URL: https://datasheet.ciiva.com/14456/sbos347d-14456374.pdf; ComponentLink2Description: https://datasheet.ciiva.com/14456/sbos347d-14456374.pdf; ComponentLink3URL: https://datasheet.ciiva.com/1798/opa379-1798312.pdf; ComponentLink3Description: https://datasheet.ciiva.com/1798/opa379-1798312.pdf; ComponentLink4URL: https://datasheet.ciiva.com/1798/opa379-1798313.pdf; ComponentLink4Description: https://datasheet.ciiva.com/1798/opa379-1798313.pdf; ComponentLink5URL: https://datasheet.ciiva.com/1798/opa379-1798314.pdf; ComponentLink5Description: https://datasheet.ciiva.com/1798/opa379-1798314.pdf; ComponentLink6URL: https://datasheet.ciiva.com/7848/1848965-7848204.pdf; ComponentLink6Description: https://datasheet.ciiva.com/7848/1848965-7848204.pdf; ComponentLink7URL: https://datasheet.ciiva.com/7219/1862482-7219983.pdf; ComponentLink7Description: https://datasheet.ciiva.com/7219/1862482-7219983.pdf; Supplier Part Number 1: 1624412
X1 = ABS06-107-32.768KHZ-T: 32.768KHz 4pF Max. ESR 81 Kohms; Manufacturer: Abracon; Frequency Tolerance: 20ppm; ESR (Equivalent Series Resistance): 60kR; Frequency Stability: 175ppm; Series Resistance: 80kR; Supplier 1: Farnell; Manufacturer Part Number: ABS06-107-32.768KHZ-T; Stock 1: 7053; Pricing 1: 5=0.733, 50=0.59, 250=0.583, 500=0.582, 1500=0.581, 3000=0.58, 15000=0.579 (EUR); Mount: Surface Mount; Case/Package: 0805; Number of Pins: 2; Case Code (Metric): 2012; Case Code (Imperial): 0805; Min Operating Temperature: -40°C; Max Operating Temperature: 85°C; Packaging: Tape and Reel; Load Capacitance: 4pF; Frequency: 32.768kHz; Tolerance: 20ppm; Package Quantity: 3000; Termination: SMD/SMT; Length: 0.079inch; Height: 0.024inch; Width: 0.047inch; Radiation Hardening: No; REACH SVHC: No SVHC; Lead Free: Lead Free; ComponentLink1URL: https://datasheet.ciiva.com/23910/1759010-23910051.pdf; ComponentLink1Description: https://datasheet.ciiva.com/23910/1759010-23910051.pdf; ComponentLink2URL: https://datasheet.ciiva.com/24028/abs06-107-32-768khz-t-24028377.pdf; ComponentLink2Description: https://datasheet.ciiva.com/24028/abs06-107-32-768khz-t-24028377.pdf; ComponentLink3URL: https://datasheet.ciiva.com/29630/abs06-107-32-768khz-t-29630938.pdf; ComponentLink3Description: https://datasheet.ciiva.com/29630/abs06-107-32-768khz-t-29630938.pdf; ComponentLink4URL: https://datasheet.ciiva.com/29630/abs06-107-32-768khz-t-29630939.pdf; ComponentLink4Description: https://datasheet.ciiva.com/29630/abs06-107-32-768khz-t-29630939.pdf; Supplier Part Number 1: 2467860
Y1 = ABM7-10.000MHZ-D2Y-T: Crystal 10MHz 18pF 2-Pin SMD T/R; Manufacturer: Abracon; Frequency Tolerance: ±20 ppm; Frequency Stability: ±30 ppm; Series Resistance: 60 Ohm; Frequency Aging: ±5(1st) ppm/Year; Mode of Oscillation: Fundamental; Supplier 1: Farnell; Manufacturer Part Number: ABM7-10.000MHZ-D2Y-T; Package: 2SMD; Standard Frequency: 10 MHz; Load Capacitance: 18 pF; Type: Crystal; Maximum Operating Temperature: 85 °C; Minimum Operating Temperature: -40 °C; Mounting: Surface Mount; Category: Crystals; ComponentLink1URL: https://datasheet.ciiva.com/16397/abm7-16397372.pdf; ComponentLink1Description: https://datasheet.ciiva.com/16397/abm7-16397372.pdf; Supplier Part Number 1: 2849434